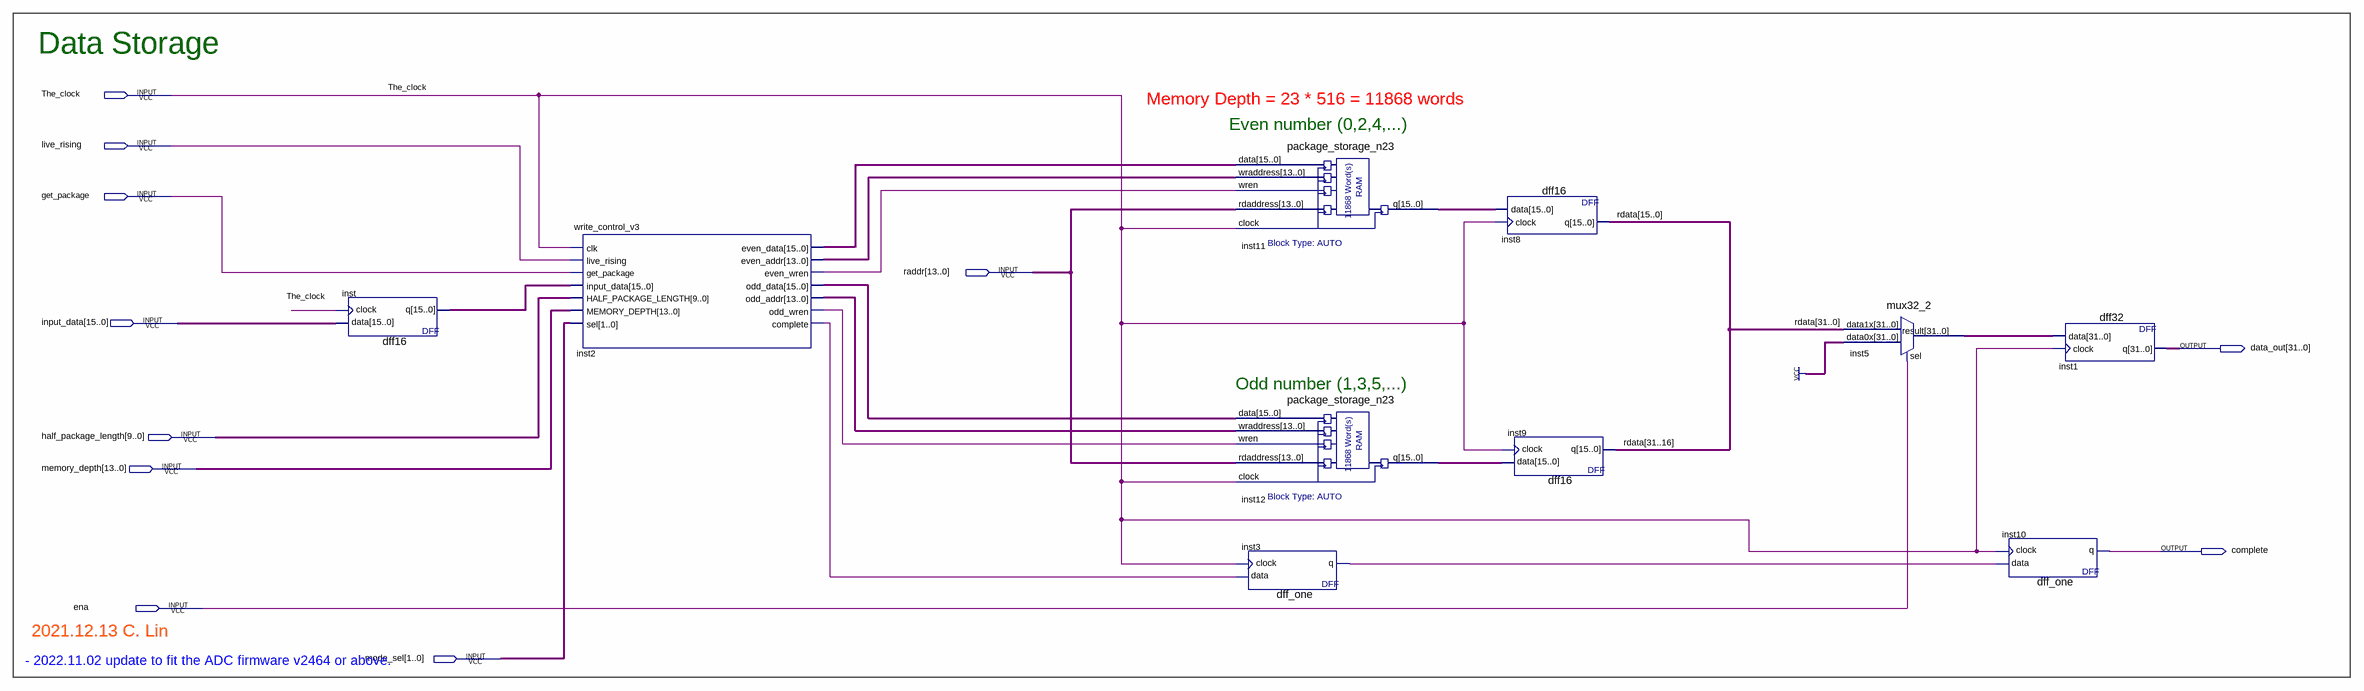
[diagram p0: schematic sheet]
// Quartus schematic data_storage.bdf as structural Verilog: 10 symbols, 11 pins
module data_storage (
  input  The_clock,
  input  live_rising,
  input  get_package,
  input  [13:0] raddr,
  input  [15:0] input_data,
  input  [9:0] half_package_length,
  input  [13:0] memory_depth,
  input  ena,
  input  [1:0] mode_sel,
  output [31:0] data_out,
  output complete
);

  wire inst2_complete, inst2_even_wren, inst2_odd_wren, inst3_q;
  wire [13:0] inst2_even_addr, inst2_odd_addr;
  wire [15:0] inst2_even_data, inst2_odd_data, inst11_q, inst12_q, inst_q;
  wire [31:0] inst5_result, rdata;

  dff16 inst (.data(input_data), .clock(The_clock), .q(inst_q));
  write_control_v3 inst2 (
    .clk(The_clock), .live_rising(live_rising), .get_package(get_package), .input_data(inst_q),
    .HALF_PACKAGE_LENGTH(half_package_length), .MEMORY_DEPTH(memory_depth), .sel(mode_sel),
    .even_data(inst2_even_data), .even_addr(inst2_even_addr), .even_wren(inst2_even_wren),
    .odd_data(inst2_odd_data), .odd_addr(inst2_odd_addr), .odd_wren(inst2_odd_wren), .complete(inst2_complete));
  package_storage_n23 inst11 (
    .data(inst2_even_data), .wraddress(inst2_even_addr), .wren(inst2_even_wren), .rdaddress(raddr),
    .clock(The_clock), .q(inst11_q));
  package_storage_n23 inst12 (
    .data(inst2_odd_data), .wraddress(inst2_odd_addr), .wren(inst2_odd_wren), .rdaddress(raddr),
    .clock(The_clock), .q(inst12_q));
  dff_one inst3 (.data(inst2_complete), .clock(The_clock), .q(inst3_q));
  dff16 inst8 (.data(inst11_q), .clock(The_clock), .q(rdata[15:0]));
  dff16 inst9 (.data(inst12_q), .clock(The_clock), .q(rdata[31:16]));
  mux32_2 inst5 (.data1x(rdata), .data0x({32{1'b1}}), .sel(ena), .result(inst5_result));
  dff_one inst10 (.data(inst3_q), .clock(The_clock), .q(complete));
  dff32 inst1 (.data(inst5_result), .clock(The_clock), .q(data_out));

  // Notes on the sheet:
  //   Data Storage
  //   Memory Depth = 23 * 516 = 11868 words
  //   Even number (0,2,4,...)
  //   Odd number (1,3,5,...)
  //   2021.12.13 C. Lin
  //   - 2022.11.02 update to fit the ADC firmware v2464 or above.
endmodule
